# Altium project Beetech GSM MKR1400 ver3.PrjPcb
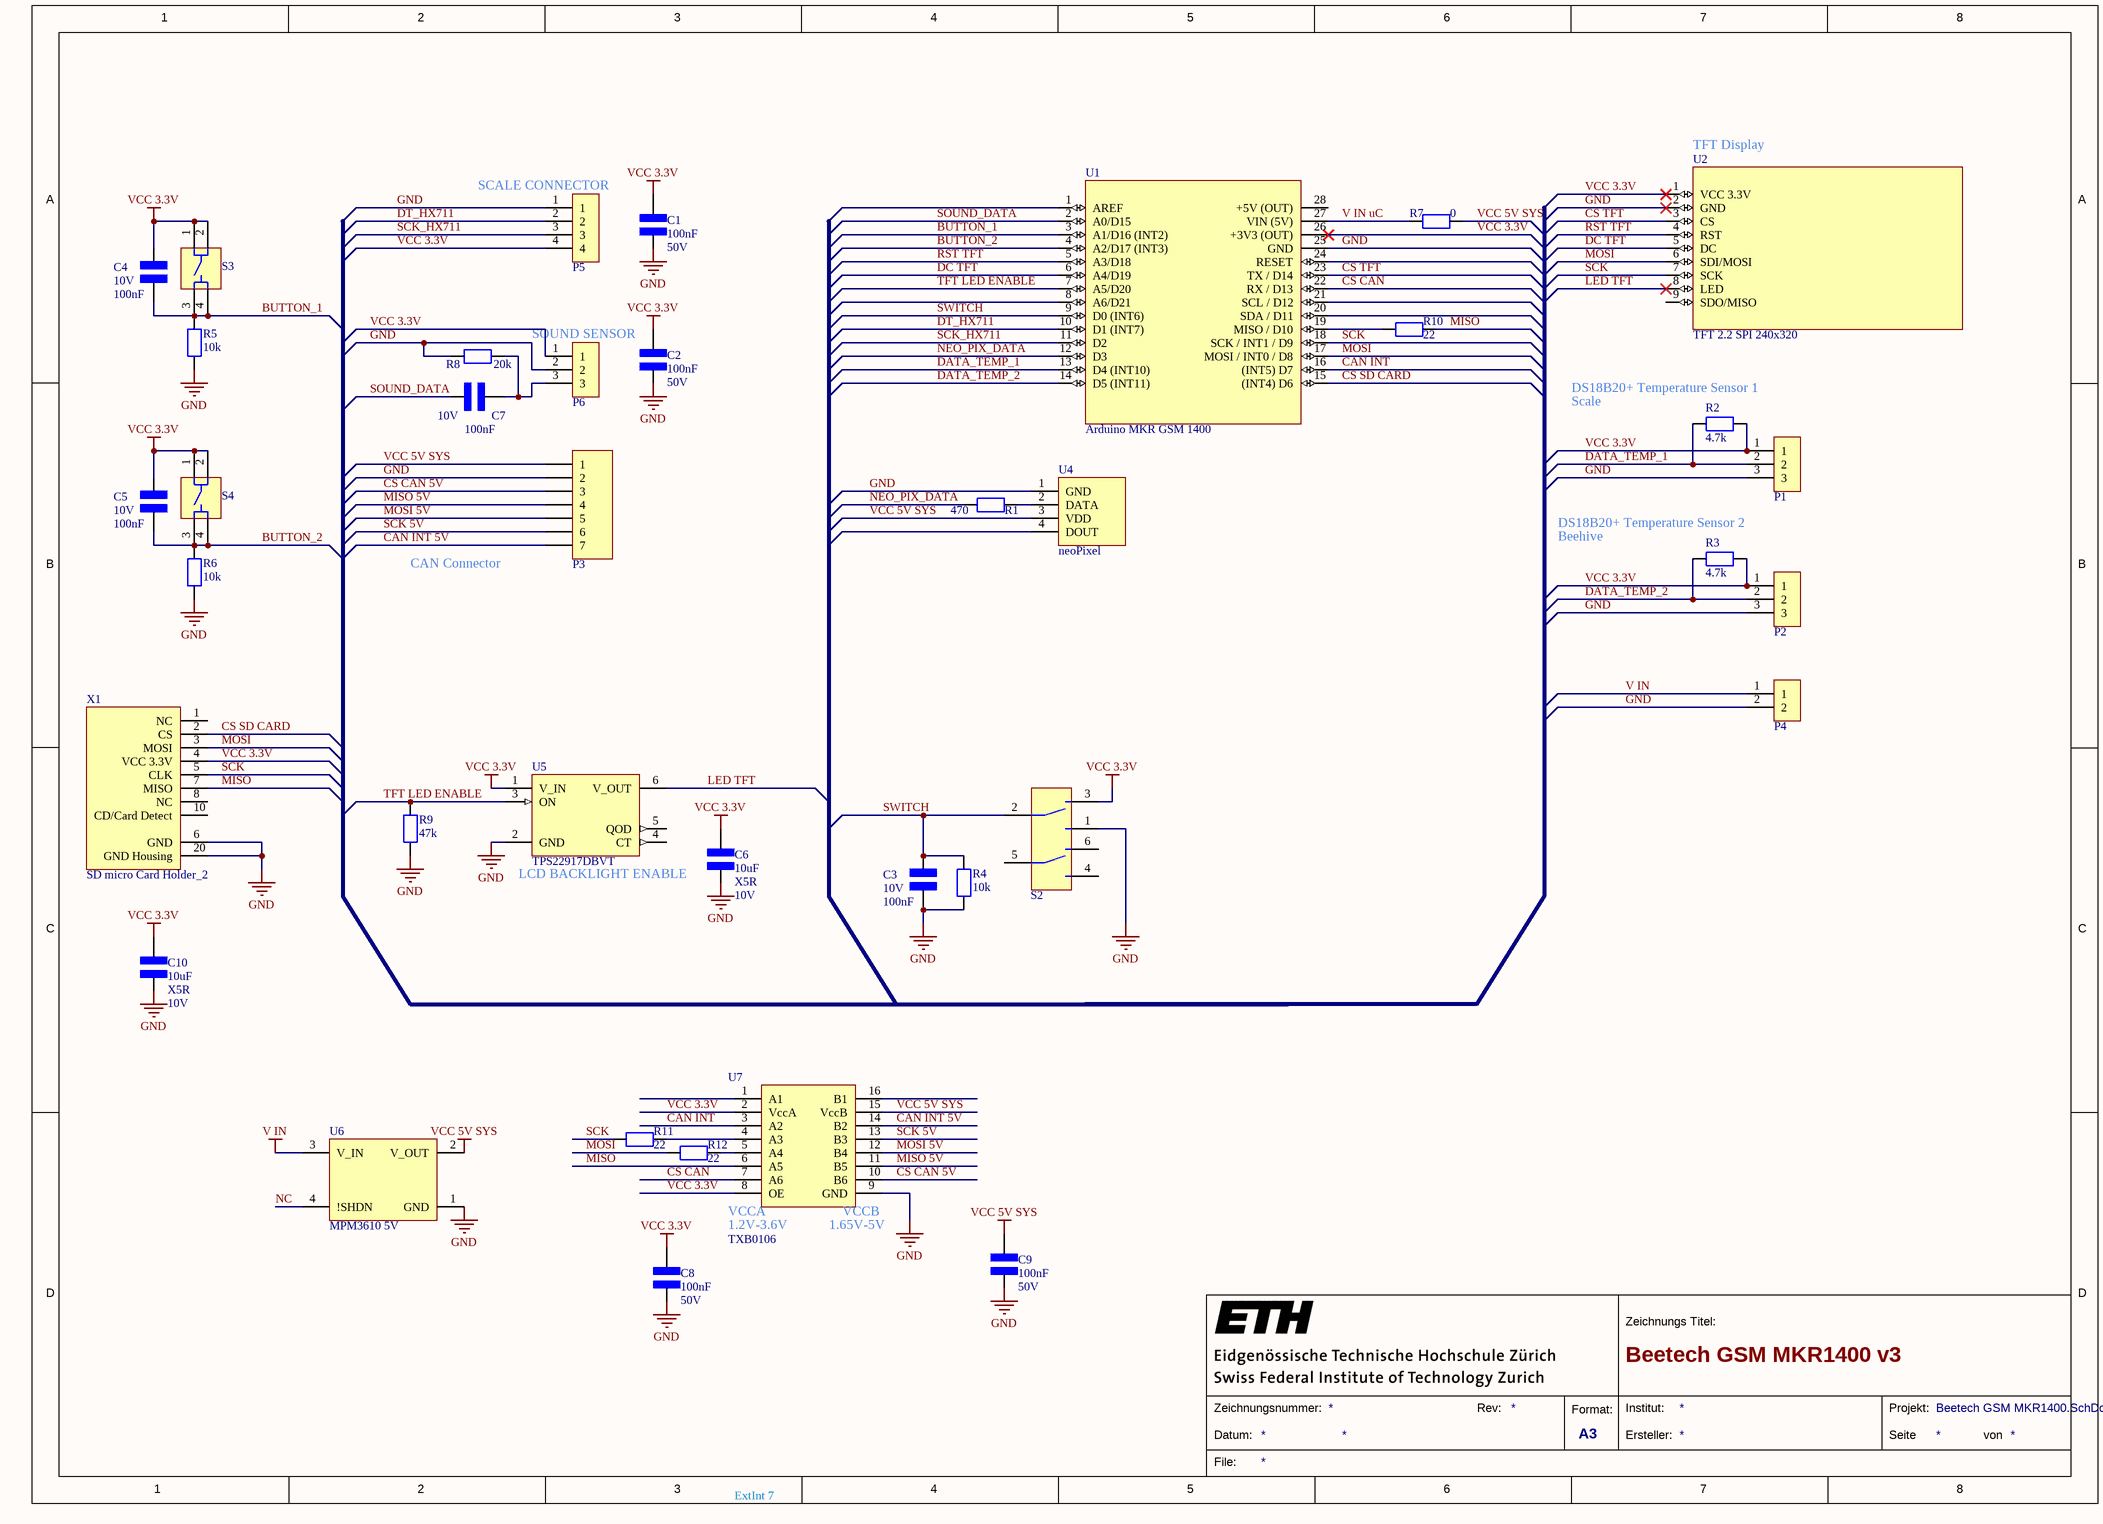
[diagram p0: Beetech GSM MKR1400.SchDoc]
1 sheet, 38 parts. Net scope: global (net labels, ports and power ports of the same name join across sheets).
Board file: Beetech GSM MKR1400.PcbDoc

## Sheet Beetech GSM MKR1400.SchDoc: Beetech GSM MKR1400 v3
size A3

### Parts
C1  value 100nF  Umax: 50V  [CAP 0603]  (hidden comment: 100nF 0603_1)
C2  value 100nF  Umax: 50V  [CAP 0603]  (hidden comment: 100nF 0603_1)
C3  value 100nF  Umax: 10V  [CAP 0603]  (hidden comment: 100nF 0603)
C4  value 100nF  Umax: 10V  [CAP 0603]  (hidden comment: 100nF 0603)
C5  value 100nF  Umax: 10V  [CAP 0603]  (hidden comment: 100nF 0603)
C6  value 10uF  Dielektrikum: X5R  Umax: 10V  [CAP 0603]  (hidden comment: 10uF 0603)
C7  value 100nF  Umax: 10V  [CAP 0603]  (hidden comment: 100nF 0603)
C8  value 100nF  Umax: 50V  [CAP 0603]  (hidden comment: 100nF 0603_1)
C9  value 100nF  Umax: 50V  [CAP 0603]  (hidden comment: 100nF 0603_1)
C10  value 10uF  Dielektrikum: X5R  Umax: 10V  [CAP 0603]  (hidden comment: 10uF 0603)
P1  3-Pin Right Angle Housing  [3PIN - RND 205-EK254-2.54-03P]  (value not drawn)
P2  3-Pin Right Angle Housing  [3PIN - RND 205-EK254-2.54-03P]  (value not drawn)
P3  8-Pin  [7PIN]  (value not drawn)
P4  2-Pin Right Angle Housing  [2PIN - RND 205-EK254-2.54-02P]  (value not drawn)
P5  4-Pin Right Angle Housing  [4PIN - RND 205-EK254-2.54-04P]  (value not drawn)
P6  3-Pin Right Angle Housing  [3PIN - RND 205-EK254-2.54-03P]  (value not drawn)
R1  value 470  [RES 0603 FOOTPRINT]  (hidden comment: 470 Ohm 0603)
R2  value 4.7k  [RES 0603 FOOTPRINT]  (hidden comment: 4.7k Ohm 0603)
R3  value 4.7k  [RES 0603 FOOTPRINT]  (hidden comment: 4.7k Ohm 0603)
R4  value 10k  [RES 0603 FOOTPRINT]  (hidden comment: 10k Ohm 0603)
R5  value 10k  [RES 0603 FOOTPRINT]  (hidden comment: 10k Ohm 0603)
R6  value 10k  [RES 0603 FOOTPRINT]  (hidden comment: 10k Ohm 0603)
R7  value 0  [RES 0603 FOOTPRINT]  (hidden comment: 0 Ohm 0603)
R8  value 20k  [RES 0603 FOOTPRINT]  (hidden comment: 20k Ohm 0603)
R9  value 47k  [RES 0603 FOOTPRINT]  (hidden comment: 47k Ohm 0603)
R10  value 22  [RES 0603 FOOTPRINT]  (hidden comment: 22 Ohm 0603)
R11  value 22  [RES 0603 FOOTPRINT]  (hidden comment: 22 Ohm 0603)
R12  value 22  [RES 0603 FOOTPRINT]  (hidden comment: 22 Ohm 0603)
S2  Schiebeschalter EG2207  [Schiebeschalter on-on 2 P, EG2207]  (value not drawn)
S3  Taster Print_SMD_3  [Taster Print - SMD - PTS647SM70SMTR2LFS]  (value not drawn)
S4  Taster Print_SMD_3  [Taster Print - SMD - PTS647SM70SMTR2LFS]  (value not drawn)
U1  Arduino MKR GSM 1400  [Arduino GSM MKR 1400 v2]
U2  TFT 2.2 SPI 240x320  [TFT 2.2 SPI 240x320]
U4  neoPixel  [neoPixel 5050 adafruit 1655]
U5  TPS22917DBVT  [SOT23 - 6]
U6  MPM3610 5V  [MPM3610 Buck Converter]
U7  TXB0106  [TSSOP-16L]
X1  SD micro Card Holder_2  [SD Card Holder - micro - 2 - sd Card inserted]

### Nets
GND: C1.1 C2.1 C3.2 C6.1 C8.1 C9.1 C10.1 P1.3 P2.3 P3.2 P4.2 P5.1 P6.2 R4.1 R5.1 R6.1 R8.1 R9.1 S2.1 U1.25(GND) U2.2(GND) U4.1(GND) U5.2(GND) U6.1(GND) U7.9(GND) X1.6(GND) X1.20(GND_Housing)
V IN: P4.1 U6.3(V_IN)
VCC 3.3V: C1.2 C2.2 C4.1 C5.1 C6.2 C8.2 C10.2 P1.1 P2.1 P5.4 P6.1 R2.1 R3.1 S2.3 S3.1 S3.2 S4.1 S4.2 U1.26(+3V3_(OUT)) U2.1(VCC_3.3V) U5.1(V_IN) U7.2(VccA) U7.8(OE) X1.4(VCC_3.3V)
VCC 5V SYS: C9.2 P3.1 R7.2 U4.3(VDD) U6.2(V_OUT) U7.15(VccB)
BUTTON_1: C4.2 R5.2 S3.3 S3.4 U1.3(A1/D16_(INT2))
BUTTON_2: C5.2 R6.2 S4.3 S4.4 U1.4(A2/D17_(INT3))
CAN INT: U1.16((INT5)_D7) U7.3(A2)
CAN INT 5V: P3.7 U7.14(B2)
CS CAN: U1.22(RX_/_D13) U7.7(A6)
CS CAN 5V: P3.3 U7.10(B6)
CS SD CARD: U1.15((INT4)_D6) X1.2(CS)
CS TFT: U1.23(TX_/_D14) U2.3(CS)
DATA_TEMP_1: P1.2 R2.2 U1.13(D4_(INT10))
DATA_TEMP_2: P2.2 R3.2 U1.14(D5_(INT11))
DC TFT: U1.6(A4/D19) U2.5(DC)
DT_HX711: P5.2 U1.10(D1_(INT7))
LED TFT: U2.8(LED) U5.6(V_OUT)
MISO: R10.2 U7.6(A5) X1.7(MISO)
MISO 5V: P3.4 U7.11(B5)
MOSI: R12.1 U1.17(MOSI_/_INT0_/_D8) U2.6(SDI/MOSI) X1.3(MOSI)
MOSI 5V: P3.5 U7.12(B4)
NC: U6.4(!SHDN)
NEO_PIX_DATA: R1.1 U1.12(D3)
RST TFT: U1.5(A3/D18) U2.4(RST)
SCK: R11.1 U1.18(SCK_/_INT1_/_D9) U2.7(SCK) X1.5(CLK)
SCK 5V: P3.6 U7.13(B3)
SCK_HX711: P5.3 U1.11(D2)
SOUND_DATA: C7.1 U1.2(A0/D15)
SWITCH: C3.1 R4.2 S2.2 U1.9(D0_(INT6))
TFT LED ENABLE: R9.2 U1.7(A5/D20) U5.3(ON)
V IN uC: R7.1 U1.27(VIN_(5V))
NetC7_2: C7.2 P6.3 R8.2
NetR1_2: R1.2 U4.2(DATA)
NetR10_1: R10.1 U1.19(MISO_/_D10)
NetR11_2: R11.2 U7.4(A3)
NetR12_2: R12.2 U7.5(A4)

Not connected (* = marked no-connect by the designer): S2 4 5 6; U1 1(AREF) 8(A6/D21) 20(SDA_/_D11) 21(SCL_/_D12) 24(RESET) 28(+5V_(OUT)); U2 9(SDO/MISO); U4 4(DOUT); U5 4(CT) 5(QOD); U7 1(A1) 16(B1); X1 1(NC) 8(NC) 10(CD/Card_Detect)

### Notes on the sheet
- (near U2) TFT Display
- (near P5) SCALE CONNECTOR
- (near P6) SOUND SENSOR
- (near R2) DS18B20+ Temperature Sensor 1
- Scale
- CAN Connector
- (near R3) DS18B20+ Temperature Sensor 2
- Beehive
- (near U5) LCD BACKLIGHT ENABLE
- ExtInt 7
- 1
- 2
- 3
- 4
- 5
- 6
- 7
- 8
- A
- B
- C
- D
- Zeichnungs Titel:
- Datum:
- Zeichnungsnummer:
- Rev:
- Format:
- A3
- Ersteller:
- Institut:
- Seite
- Projekt:
- von
- File:
- (in symbol TXB0106 Level Converter) VCCA; VCCB; 1.2V-3.6V; 1.65V-5V

### Library data of the parts
C1 C2 C8 C9 = 100nF 0603_1: C CERAMIC SMD; Bezeichnung: C SMD; Hersteller: Yageo; Hersteller Nr: CC0603JPX7R9BB104; Haendler: Mouser; Haendler Nr: 603-CC0603JPX79BB104; Preis (CHF): 0.15; housing/footprint: 0603
C3-C5 C7 = 100nF 0603: C CERAMIC SMD; Bezeichnung: C SMD; Hersteller: Würth; Hersteller Nr: 885012206020; Haendler: Mouser; Haendler Nr: 710-885012206020; Preis (CHF): 0.05; housing/footprint: 0603
C6 C10 = 10uF 0603: C CERAMIC SMD; Bezeichnung: C SMD; Hersteller: TDK; Hersteller Nr: C1608X5R1A106K080AC; Haendler: Mouser; Haendler Nr: 810-C1608X5R1A106K; Preis (CHF): 0.5; housing/footprint: 0603
P1 P2 P6 = 3-Pin Screw Terminal: 3-Pin; Preis (CHF): 0.60; Haendler: Distrelec; Haendler Nr: 301-27-919; ComponentLink1Description: Mouser; ComponentLink1URL: https://www.mouser.ch/ProductDetail/TE-Connectivity/640453-2?qs=sGAEpiMZZMs%252bGHln7q6pm5E1Eb6qwPl2KIU5TYv3tVY%3d
P3 = 7-Pin: LatestRevisionDate: 17-Jul-2002; LatestRevisionNote: Re-released for DXP Platform.; Publisher: Altium Limited
P4 = 2-Pin Screw Terminal: 2-Pin; Preis (CHF): 0.60; Haendler: Distrelec; Haendler Nr: 301-27-918; ComponentLink1Description: Mouser; ComponentLink1URL: https://www.mouser.ch/ProductDetail/TE-Connectivity/640453-2?qs=sGAEpiMZZMs%252bGHln7q6pm5E1Eb6qwPl2KIU5TYv3tVY%3d
P5 = 4-Pin Screw Terminal: 4-Pin; Preis (CHF): 0.60; Haendler: Distrelec; Hersteller: RND; Hersteller Nr: RND 205-EK254-2.54-04P; Haendler Nr: 301-27-920; ComponentLink1Description: Mouser; ComponentLink1URL: https://www.mouser.ch/ProductDetail/TE-Connectivity/640453-2?qs=sGAEpiMZZMs%252bGHln7q6pm5E1Eb6qwPl2KIU5TYv3tVY%3d
R1 = 470 Ohm 0603: R SMD; Preis (CHF): 0.15; Haendler: Mouser; HAendler Nr: 594-MCT06030C4700FP5; Bezeichnung: R SMD; housing/footprint: 0603
R2 R3 = 4.7k Ohm 0603: R SMD; Haendler: Mouser; Haendler Nr: 755-ESR03EZPF4701; Preis (CHF): 0.01; Bezeichnung: R SMD; housing/footprint: 0603
R4-R6 = 10k Ohm 0603: R SMD; Hersteller: Yageo; Hersteller Nr: AC0603FR-0710KL; Haendler: Mouser; Haendler Nr: 603-AC0603FR-0710KL; Preis (CHF): 0.01; Bezeichnung: R SMD; housing/footprint: 0603
R7 = 0 Ohm 0603: R SMD; Hersteller: ERJ-3GEY0R00V; Hersteller Nr: Panasonic; Haendler: Mouser; Haendler Nr: 667-ERJ-3GEY0R00V; Preis (CHF): 0.01; Bezeichnung: R SMD; housing/footprint: 0603
R8 = 20k Ohm 0603: R SMD; Haendler: Mouser; Haendler Nr: 71-CRCW060320K0FKEAC; Preis (CHF): 0.09; Bezeichnung: R SMD; housing/footprint: 0603
R9 = 47k Ohm 0603: R SMD; Hersteller: Yageo; Hersteller Nr: AC0603FR-0747KL; Haendler: Mouser; Haendler Nr: 603-AC0603FR-0747KL; Preis (CHF): 0.01; Bezeichnung: R SMD; housing/footprint: 0603
R10-R12 = 22 Ohm 0603: R SMD; Haendler2: Farnell; Haendler2 Nr: 2447301; Preis (CHF): 0.01; Haendler: Mouser; HAendler Nr: 603-RC0603FR-0722RL; Bezeichnung: R SMD; housing/footprint: 0603
S2 = Schiebeschalter EG2207: Schiebeschalter on-on PCM12SMTR; Haendler: Mouser; Haendler Nr: 612-EG2207; Preis (CHF): 0.66; Hersteller: E SWITCH; Hersteller Nr: EG2207; ComponentLink1Description: C&K; ComponentLink1URL: https://www.ckswitches.com/products/switches/product-details/Slide/AYZ/AYZ0202AGRLC/
S3 S4 = Taster Print_SMD_6: Taster; Haendler Nr: 611-PTS647SM70SMTR2L; Haendler: Mouser; Preis (CHF): 0.38; Link: https://www.mouser.ch/ProductDetail/CK/PTS647SM70SMTR2LFS?qs=PqoDHHvF64%252Bxl5nIb9IaOw%3D%3D; ComponentLink1Description: link; ComponentLink1URL: https://www.digikey.ch/product-detail/de/wurth-electronics-inc/430473035826/732-7021-1-ND/5225469
U1 = Arduino MKR GSM 1400: https://store.arduino.cc/arduino-mkr-gsm-1400-1415; Preis (CHF): 75; Link: https://store.arduino.cc/arduino-mkr-gsm-1400-1415; ComponentLink3URL: http://ch.farnell.com/stmicroelectronics/stm32l496vgt6/mcu-arm-cortex-m4-80mhz-lqfp-100/dp/2725139?st=STM32L496VGT6
U2 = TFT 2.2 SPI 240x320: https://www.banggood.com/1_441_82_02_22_4-Inch-TFT-LCD-Display-Module-Colorful-Screen-Module-SPI-Interface-p-1494883.html?rmmds=search&ID=6211522&cur_warehouse=CN; Preis (CHF): 6; Haendler: Banggood / Aliexpress; Link: https://www.banggood.com/1_441_82_02_22_4-Inch-TFT-LCD-Display-Module-Colorful-Screen-Module-SPI-Interface-p-1494883.html?rmmds=search&ID=6211522&cur_warehouse=CN; ComponentLink3URL: http://ch.farnell.com/stmicroelectronics/stm32l496vgt6/mcu-arm-cortex-m4-80mhz-lqfp-100/dp/2725139?st=STM32L496VGT6; Link 2: https://de.aliexpress.com/item/4000839144387.html?spm=a2g0o.productlist.0.0.48ed5371jjv3wJ&algo_pvid=f087815a-197e-468a-8055-d99fc6734484&algo_expid=f087815a-197e-468a-8055-d99fc6734484-8&btsid=0ab50f6115912653966648062e4a8e&ws_ab_test=searchweb0_0,searchweb201602_,searchweb201603_
U4 = neoPixel 5050 adafruit 1655: Preis (CHF): 0.60; Haendler Nr: 485-1655; Haendler: Mouser; Hersteller Nr: 1655; ComponentLink1Description: Mouser; ComponentLink1URL: https://www.mouser.ch/ProductDetail/TE-Connectivity/640453-2?qs=sGAEpiMZZMs%252bGHln7q6pm5E1Eb6qwPl2KIU5TYv3tVY%3d; Hersteller: Adafruit
U5 = TPS22917DBVT: High Side Switch; Hersteller: TI; Preis (CHF): 0.6; Haendler Nr: 595-TPS22917DBVT; Haendler: Mouser; Code_JEDEC: SOT 23-6; Hersteller Nr: TPS22917DBVT; Link: https://www.mouser.ch/ProductDetail/Texas-Instruments/TPS22917DBVT?qs=sGAEpiMZZMve4%2fbfQkoj%252bPJ2V24ZqG0%252bKgHGtqls2rU%3d
U6 = MPM3610 5V Buck Converter Breakout: MPM3610 5V Buck Converter Breakout - 21V In 5V Out at 1.2A; Hersteller: Adafruit; Hersteller Typ: 4739; Preis (CHF): 5.95; Haendler Nr: 485-4739; Haendler: Mouser; Link: https://www.adafruit.com/product/4739
U7 = TXB0106 Level Converter: Level Converter TXB0106; Hersteller: Texas Instruments; Haendler: Mouser; Haendler Nr: 595-TXB0106PWR; Preis (CHF): 1.45; Haendler2: Farnell; Haendler2 Nr: 1694679; Hersteller Nr: TXB0106; Link: http://ch.farnell.com/texas-instruments/txb0106pwr/txb-transceiver-tssop16/dp/1694679?ost=1694679&searchView=table&iscrfnonsku=false&ddkey=http%3Ade-CH%2FElement14_Switzerland%2Fsearch
X1 = SD micro Card Holder_2: SD micro Card  Holder; Hersteller Nr: 502774-0891; Hersteller: Molex; Haendler2 Nr: 2064063; Haendler2: Farnell; Preis (CHF): 3.15; Haendler: Mouser; Haendler Nr: 538-502774-0891